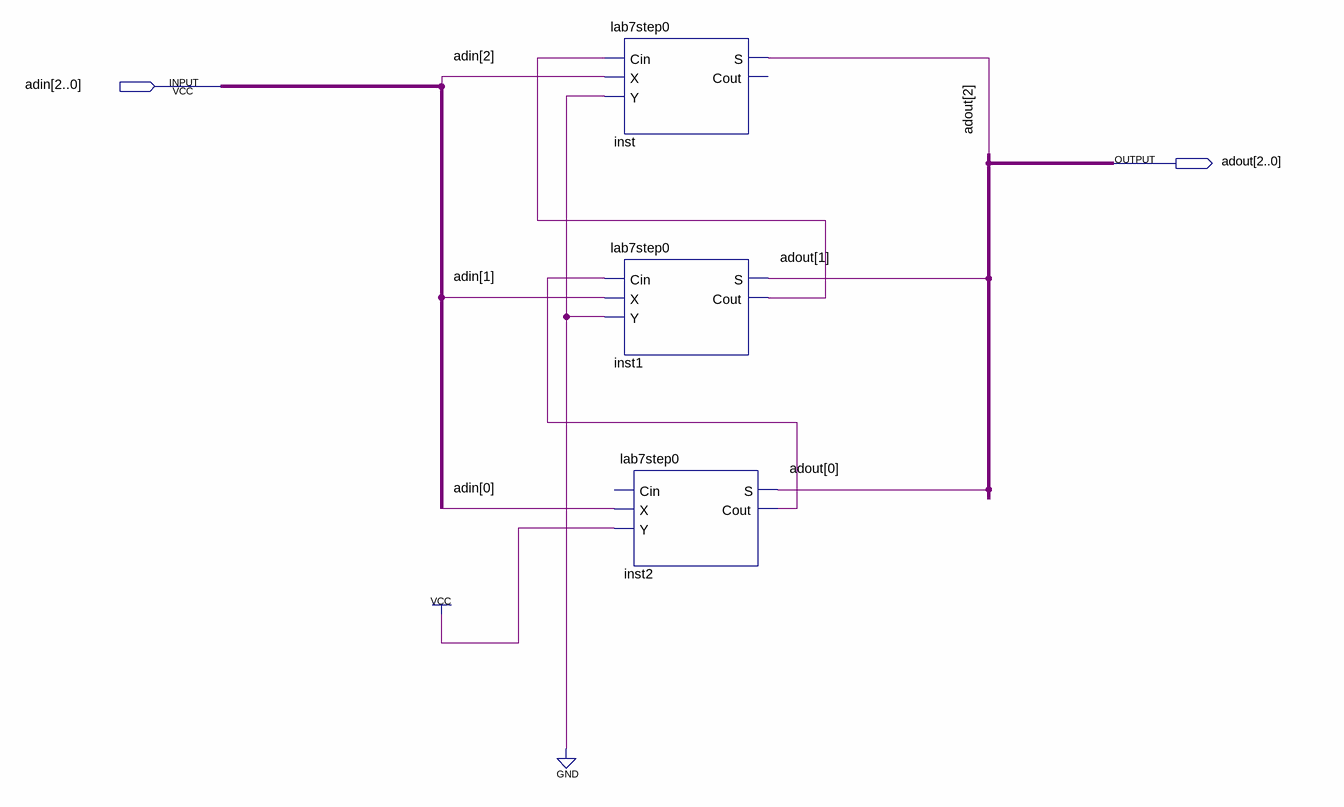
[diagram p0: schematic sheet]
// Quartus schematic next_3bitadder.bdf as structural Verilog: 3 symbols, 2 pins
module next_3bitadder (
  input  [2:0] adin,
  output [2:0] adout
);

  wire inst1_cout, inst2_cout;

  lab7step0 inst (.Cin(inst1_cout), .X(adin[2]), .Y(1'b0), .S(adout[2]));  // open: Cout
  lab7step0 inst1 (.Cin(inst2_cout), .X(adin[1]), .Y(1'b0), .S(adout[1]), .Cout(inst1_cout));
  lab7step0 inst2 (.X(adin[0]), .Y(1'b1), .S(adout[0]), .Cout(inst2_cout));  // open: Cin
endmodule
